# EAGLE board Eagle_LEDCUBE1 (EAGLE 6.5.0)
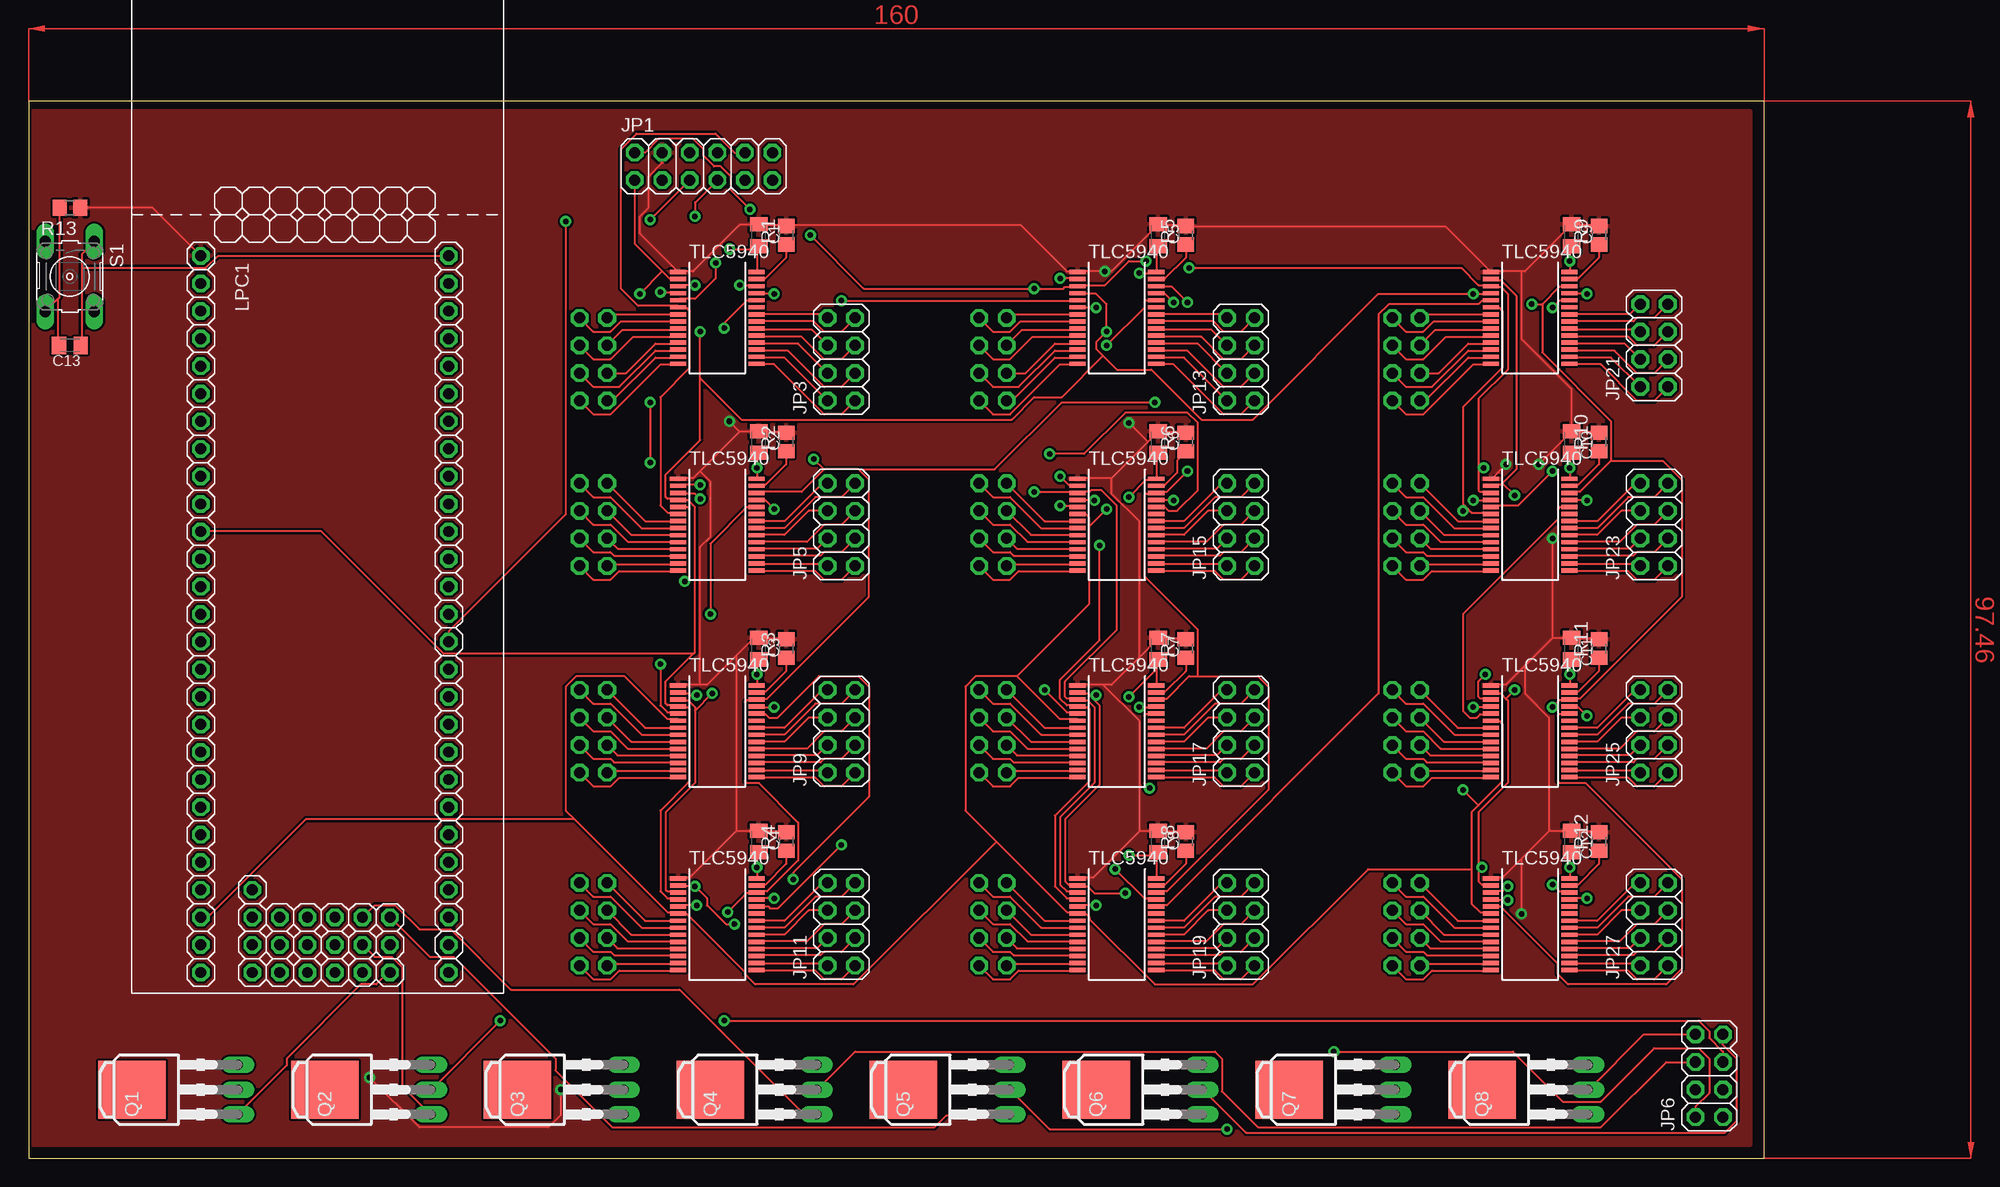
[diagram p5: board, top side]
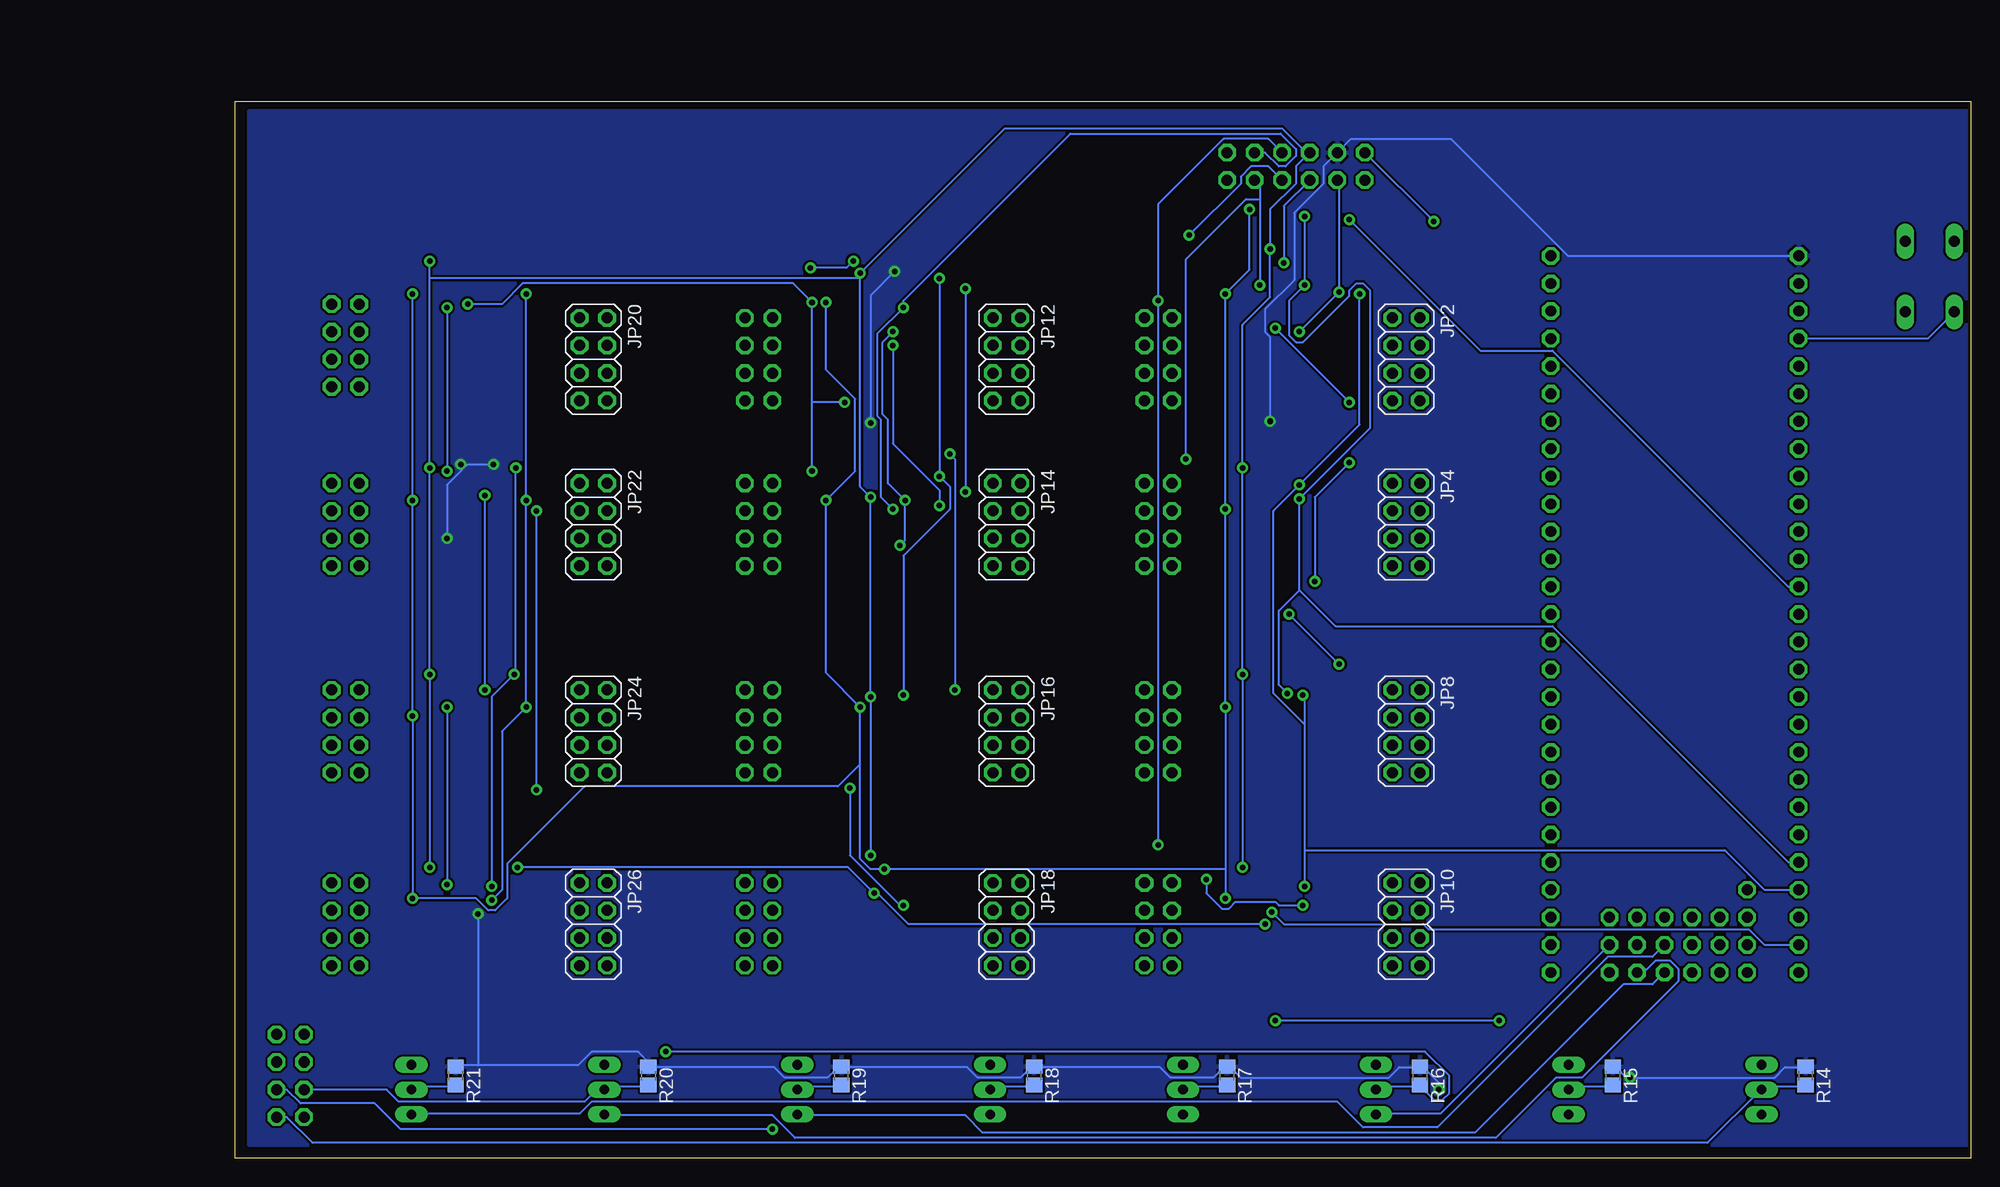
[diagram p6: board, bottom side, seen from below]

Size 160 x 97.46 mm. Coordinates in mm from the lower left corner, seen from the top.
Outline: 0,0 160,0 160,97.46 0,97.46 0,0
Copper layers (1*16): Top 0.035mm / dielectric 1.5mm / Bottom 0.035mm
Design rules "8mils": minimum track width 8mil, minimum drill 20mil, track to track 8mil, track to pad 8mil, pad to pad 8mil, via to via 8mil, smd to smd 8mil, copper to edge 10mil, drill to drill 8mil, minimum pad ring 12mil, minimum via ring 10mil, stop-mask expansion 4mil, vias tented up to drill 25mil, thermal gap 10mil

## Footprints (pad centres in the part's own frame; a part is rotated, then mirrored left to right if it is on the bottom)
C0805K = smd 1.3 x 1.6: 1 -1,0; 2 1,0
IC-SSOP28 = smd 0.4 x 1.5: 1 -4.225,-3.625; 2 -3.575,-3.625; 3 -2.925,-3.625; 4 -2.275,-3.625; 5 -1.625,-3.625; 6 -0.975,-3.625; 7 -0.325,-3.625; 8 0.325,-3.625; 9 0.975,-3.625; 10 1.625,-3.625; 11 2.275,-3.625; 12 2.925,-3.625; 13 3.575,-3.625; 14 4.225,-3.625; 15 4.225,3.625; 16 3.575,3.625; 17 2.925,3.625; 18 2.275,3.625; 19 1.625,3.625; 20 0.975,3.625; 21 0.325,3.625; 22 -0.325,3.625; 23 -0.975,3.625; 24 -1.625,3.625; 25 -2.275,3.625; 26 -2.925,3.625; 27 -3.575,3.625; 28 -4.225,3.625
2X06 = drill 1.016 octagon: 1 -6.35,-1.27; 2 -6.35,1.27; 3 -3.81,-1.27; 4 -3.81,1.27; 5 -1.27,-1.27; 6 -1.27,1.27; 7 1.27,-1.27; 8 1.27,1.27; 9 3.81,-1.27; 10 3.81,1.27; 11 6.35,-1.27; 12 6.35,1.27
2X04 = drill 1.016 octagon: 1 -3.81,-1.27; 2 -3.81,1.27; 3 -1.27,-1.27; 4 -1.27,1.27; 5 1.27,-1.27; 6 1.27,1.27; 7 3.81,-1.27; 8 3.81,1.27
LPCXPRESSO_LPC1769 = drill 1 octagon: 1 33.655,-5.715; 2 36.195,-5.715; 3 38.735,-5.715; 4 41.275,-5.715; 5 43.815,-5.715; 6 46.355,-5.715; 7 48.895,-5.715; 8 51.435,-5.715; 9 53.975,-5.715; 10 56.515,-5.715; 11 59.055,-5.715; 12 61.595,-5.715; 13 64.135,-5.715; 14 66.675,-5.715; 15 69.215,-5.715; 16 71.755,-5.715; 17 74.295,-5.715; 18 76.835,-5.715; 19 79.375,-5.715; 20 81.915,-5.715; 21 84.455,-5.715; 22 86.995,-5.715; 23 89.535,-5.715; 24 92.075,-5.715; 25 94.615,-5.715; 26 97.155,-5.715; 27 99.695,-5.715; 28 33.655,17.145; 29 36.195,17.145; 30 38.735,17.145; 31 41.275,17.145; 32 43.815,17.145; 33 46.355,17.145; 34 48.895,17.145; 35 51.435,17.145; 36 53.975,17.145; 37 56.515,17.145; 38 59.055,17.145; 39 61.595,17.145; 40 64.135,17.145; 41 66.675,17.145; 42 69.215,17.145; 43 71.755,17.145; 44 74.295,17.145; 45 76.835,17.145; 46 79.375,17.145; 47 81.915,17.145; 48 84.455,17.145; 49 86.995,17.145; 50 89.535,17.145; 51 92.075,17.145; 52 94.615,17.145; 53 97.155,17.145; 54 99.695,17.145; 55 92.075,-0.965; 56 94.615,-0.965; 57 97.155,-0.965; 58 99.695,-0.965; 59 94.615,1.575; 60 97.155,1.575; 61 99.695,1.575; 62 94.615,4.115; 63 97.155,4.115; 64 99.695,4.115; 65 94.615,6.655; 66 97.155,6.655; 67 99.695,6.655; 68 94.615,9.195; 69 97.155,9.195; 70 99.695,9.195; 71 94.615,11.735; 72 97.155,11.735; 73 99.695,11.735
TO251AA = drill 0.889 long: 1 -2.286,-5.334; 2 0,-5.334; 3 2.286,-5.334 | smd 5.334 x 6.223: 4 0,4.445
R0805 = smd 1.3 x 1.5: 1 -0.85,0; 2 0.85,0
R0805' = smd 1.3 x 1.5: 1 -0.95,0; 2 0.95,0
B3F-10XX = drill 1.016 long: 1 -3.251,2.261; 2 3.251,2.261; 3 -3.251,-2.261; 4 3.251,-2.261

## Placement (x,y rotation side)
C1  [C0805K]  67.31,85.09 270 top
C2  [C0805K]  67.31,66.04 270 top
C3  [C0805K]  67.31,46.99 270 top
C4  [C0805K]  67.31,29.21 270 top
C5  [C0805K]  104.14,85.09 270 top
C6  [C0805K]  104.14,66.04 270 top
C7  [C0805K]  104.14,46.99 270 top
C8  [C0805K]  104.14,29.21 270 top
C9  [C0805K]  142.24,85.09 270 top
C10  [C0805K]  142.24,66.04 270 top
C11  [C0805K]  142.24,46.99 270 top
C12  [C0805K]  142.24,29.21 270 top
C13  [C0805K]  3.81,74.93 180 top
IC1  [IC-SSOP28]  63.5,77.47 270 top
IC2  [IC-SSOP28]  63.5,58.42 270 top
IC3  [IC-SSOP28]  63.5,39.37 270 top
IC4  [IC-SSOP28]  63.5,21.59 270 top
IC5  [IC-SSOP28]  100.33,77.47 270 top
IC6  [IC-SSOP28]  100.33,58.42 270 top
IC7  [IC-SSOP28]  100.33,39.37 270 top
IC8  [IC-SSOP28]  100.33,21.59 270 top
IC9  [IC-SSOP28]  138.43,77.47 270 top
IC10  [IC-SSOP28]  138.43,58.42 270 top
IC11  [IC-SSOP28]  138.43,39.37 270 top
IC12  [IC-SSOP28]  138.43,21.59 270 top
JP1  [2X06]  62.23,91.44 0 top
JP2  [2X04]  52.07,73.66 270 bottom
JP3  [2X04]  74.93,73.66 90 top
JP4  [2X04]  52.07,58.42 270 bottom
JP5  [2X04]  74.93,58.42 90 top
JP6  [2X04]  154.94,7.62 90 top
JP8  [2X04]  52.07,39.37 270 bottom
JP9  [2X04]  74.93,39.37 90 top
JP10  [2X04]  52.07,21.59 270 bottom
JP11  [2X04]  74.93,21.59 90 top
JP12  [2X04]  88.9,73.66 270 bottom
JP13  [2X04]  111.76,73.66 90 top
JP14  [2X04]  88.9,58.42 270 bottom
JP15  [2X04]  111.76,58.42 90 top
JP16  [2X04]  88.9,39.37 270 bottom
JP17  [2X04]  111.76,39.37 90 top
JP18  [2X04]  88.9,21.59 270 bottom
JP19  [2X04]  111.76,21.59 90 top
JP20  [2X04]  127,73.66 270 bottom
JP21  [2X04]  149.86,74.93 90 top
JP22  [2X04]  127,58.42 270 bottom
JP23  [2X04]  149.86,58.42 90 top
JP24  [2X04]  127,39.37 270 bottom
JP25  [2X04]  149.86,39.37 90 top
JP26  [2X04]  127,21.59 270 bottom
JP27  [2X04]  149.86,21.59 90 top
LPC1  [LPCXPRESSO_LPC1769]  21.59,116.84 270 top
Q1  SPD30P06P  [TO251AA]  13.97,6.35 90 top
Q2  SPD30P06P  [TO251AA]  31.75,6.35 90 top
Q3  SPD30P06P  [TO251AA]  49.53,6.35 90 top
Q4  SPD30P06P  [TO251AA]  67.31,6.35 90 top
Q5  SPD30P06P  [TO251AA]  85.09,6.35 90 top
Q6  SPD30P06P  [TO251AA]  102.87,6.35 90 top
Q7  SPD30P06P  [TO251AA]  120.65,6.35 90 top
Q8  SPD30P06P  [TO251AA]  138.43,6.35 90 top
R1  2.2k  [R0805]  69.85,85.09 90 top
R2  2.2k  [R0805]  69.85,66.04 90 top
R3  2.2k  [R0805]  69.85,46.99 90 top
R4  2.2k  [R0805]  69.85,29.21 90 top
R5  2.2k  [R0805]  106.68,85.09 90 top
R6  2.2k  [R0805]  106.68,66.04 90 top
R7  2.2k  [R0805]  106.68,46.99 90 top
R8  2.2k  [R0805]  106.68,29.21 90 top
R9  2.2k  [R0805]  144.78,85.09 90 top
R10  2.2k  [R0805]  144.78,66.04 90 top
R11  2.2k  [R0805]  144.78,46.99 90 top
R12  2.2k  [R0805]  144.78,29.21 90 top
R13  [R0805']  3.81,87.63 180 top
R14  [R0805]  15.24,7.62 270 bottom
R15  [R0805]  33.02,7.62 270 bottom
R16  [R0805]  50.8,7.62 270 bottom
R17  [R0805]  68.58,7.62 270 bottom
R18  [R0805]  86.36,7.62 270 bottom
R19  [R0805]  104.14,7.62 270 bottom
R20  [R0805]  121.92,7.62 270 bottom
R21  [R0805]  139.7,7.62 270 bottom
S1  [B3F-10XX]  3.81,81.28 270 top

## Tracks (layer width: path | path; a pad name or v marks a point on that pad's centre or on a via)
2A1
  Top 0.203: JP12.1 90.49,77.79 96.68,77.79 IC5.7
2A2
  Top 0.203: JP12.2 88.9,76.2 90.49,76.2 91.44,77.15 96.68,77.15 IC5.8
2A3
  Top 0.203: JP12.3 91.6,76.36 96.68,76.36 IC5.9
2A4
  Top 0.203: JP12.4 88.9,73.66 90.49,73.66 92.55,75.72 96.68,75.72 IC5.10
2A5
  Top 0.203: JP12.5 91.92,72.39 94.61,75.09 96.68,75.09 IC5.11
2A6
  Top 0.203: JP12.6 88.9,71.12 91.28,71.12 94.61,74.45 96.68,74.45 IC5.12
2A7
  Top 0.203: JP12.7 90.65,69.85 94.61,73.82 96.68,73.82 IC5.13
2A8
  Top 0.203: JP12.8 88.9,68.58 90.49,68.58 95.09,73.18 96.68,73.18 IC5.14
2A9
  Top 0.203: JP13.1 111.76,68.58 110.17,68.58 105.57,73.18 103.98,73.18 IC5.15
2A10
  Top 0.203: JP13.2 106.52,73.82 103.98,73.82 IC5.16
2A11
  Top 0.203: JP13.3 111.76,71.12 110.17,71.12 106.84,74.45 103.98,74.45 IC5.17
2A12
  Top 0.203: JP13.4 107.79,75.09 103.98,75.09 IC5.18
2A13
  Top 0.203: JP13.5 111.76,73.66 110.17,73.66 108.11,75.72 103.98,75.72 IC5.19
2A14
  Top 0.203: JP13.6 109.06,76.36 103.98,76.36 IC5.20
2A15
  Top 0.203: JP13.7 111.76,76.2 110.17,76.2 109.22,77.15 103.98,77.15 IC5.21
2A16
  Top 0.203: JP13.8 110.17,77.79 103.98,77.79 IC5.22
2B1
  Top 0.203: JP14.1 93.66,58.74 96.68,58.74 IC6.7
2B2
  Top 0.203: JP14.2 88.9,60.96 90.49,60.96 93.34,58.1 96.68,58.1 IC6.8
2B3
  Top 0.203: JP14.3 92.39,57.47 96.68,57.47 IC6.9
2B4
  Top 0.203: JP14.4 88.9,58.42 90.49,58.42 92.08,56.83 96.68,56.83 IC6.10
2B5
  Top 0.203: JP14.5 91.12,56.2 96.68,56.2 IC6.11
2B6
  Top 0.203: JP14.6 88.9,55.88 90.49,55.88 90.81,55.56 96.68,55.56 IC6.12
2B7
  Top 0.203: JP14.7 90.33,54.77 96.68,54.77 IC6.13
2B8
  Top 0.203: JP14.8 88.9,53.34 90.49,53.34 91.28,54.13 96.68,54.13 IC6.14
2B9
  Top 0.203: JP15.1 111.76,53.34 110.17,53.34 109.38,54.13 103.98,54.13 IC6.15
2B10
  Top 0.203: JP15.2 110.33,54.77 103.98,54.77 IC6.16
2B11
  Top 0.203: JP15.3 111.76,55.88 110.17,55.88 109.86,55.56 103.98,55.56 IC6.17
2B12
  Top 0.203: JP15.4 109.54,56.2 103.98,56.2 IC6.18
2B13
  Top 0.203: JP15.5 111.76,58.42 110.17,58.42 108.58,56.83 103.98,56.83 IC6.19
2B14
  Top 0.203: JP15.6 108.74,59.69 106.52,57.47 103.98,57.47 IC6.20
2B15
  Top 0.203: JP15.7 111.76,60.96 109.38,60.96 106.52,58.1 103.98,58.1 IC6.21
2B16
  Top 0.203: JP15.8 110.01,62.23 106.52,58.74 103.98,58.74 IC6.22
2C1
  Top 0.203: JP16.1 93.66,39.69 96.68,39.69 IC7.7
2C2
  Top 0.203: JP16.2 88.9,41.91 90.49,41.91 93.34,39.05 96.68,39.05 IC7.8
2C3
  Top 0.203: JP16.3 92.39,38.42 96.68,38.42 IC7.9
2C4
  Top 0.203: JP16.4 88.9,39.37 90.49,39.37 92.08,37.78 96.68,37.78 IC7.10
2C5
  Top 0.203: JP16.5 91.12,37.15 96.68,37.15 IC7.11
2C6
  Top 0.203: JP16.6 88.9,36.83 90.49,36.83 90.81,36.51 96.68,36.51 IC7.12
2C7
  Top 0.203: JP16.7 90.33,35.72 96.68,35.72 IC7.13
2C8
  Top 0.203: JP16.8 88.9,34.29 90.49,34.29 91.28,35.08 96.68,35.08 IC7.14
2C9
  Top 0.203: JP17.1 111.76,34.29 110.17,34.29 109.38,35.08 103.98,35.08 IC7.15
2C10
  Top 0.203: JP17.2 110.33,35.72 103.98,35.72 IC7.16
2C11
  Top 0.203: JP17.3 111.76,36.83 110.17,36.83 109.86,36.51 103.98,36.51 IC7.17
2C12
  Top 0.203: JP17.4 109.54,37.15 103.98,37.15 IC7.18
2C13
  Top 0.203: JP17.5 111.76,39.37 110.17,39.37 108.58,37.78 103.98,37.78 IC7.19
2C14
  Top 0.203: JP17.6 108.74,40.64 106.52,38.42 103.98,38.42 IC7.20
2C15
  Top 0.203: JP17.7 111.76,41.91 109.38,41.91 106.52,39.05 103.98,39.05 IC7.21
2C16
  Top 0.203: JP17.8 110.01,43.18 106.52,39.69 103.98,39.69 IC7.22
2D1
  Top 0.203: JP18.1 93.66,21.91 96.68,21.91 IC8.7
2D2
  Top 0.203: JP18.2 88.9,24.13 90.49,24.13 93.34,21.27 96.68,21.27 IC8.8
2D3
  Top 0.203: JP18.3 92.39,20.64 96.68,20.64 IC8.9
2D4
  Top 0.203: JP18.4 88.9,21.59 90.49,21.59 92.08,20 96.68,20 IC8.10
2D5
  Top 0.203: JP18.5 91.12,19.37 96.68,19.37 IC8.11
2D6
  Top 0.203: JP18.6 88.9,19.05 90.49,19.05 90.81,18.73 96.68,18.73 IC8.12
2D7
  Top 0.203: JP18.7 90.33,17.94 96.68,17.94 IC8.13
2D8
  Top 0.203: JP18.8 88.9,16.51 90.49,16.51 91.28,17.3 96.68,17.3 IC8.14
2D9
  Top 0.203: JP19.1 111.76,16.51 110.17,16.51 109.38,17.3 103.98,17.3 IC8.15
2D10
  Top 0.203: JP19.2 110.33,17.94 103.98,17.94 IC8.16
2D11
  Top 0.203: JP19.3 111.76,19.05 110.17,19.05 109.86,18.73 103.98,18.73 IC8.17
2D12
  Top 0.203: JP19.4 109.54,19.37 103.98,19.37 IC8.18
2D13
  Top 0.203: JP19.5 111.76,21.59 110.17,21.59 108.58,20 103.98,20 IC8.19
2D14
  Top 0.203: JP19.6 108.74,22.86 106.52,20.64 103.98,20.64 IC8.20
2D15
  Top 0.203: JP19.7 111.76,24.13 109.38,24.13 106.52,21.27 103.98,21.27 IC8.21
2D16
  Top 0.203: JP19.8 110.01,25.4 106.52,21.91 103.98,21.91 IC8.22
2SIN  (via drill 0.51)
  Top 0.203: v74.93,28.89 69.06,23.02 68.42,23.02 68.26,23.18 67.15,23.18 IC4.24 | v74.93,79.06 96.68,79.06 IC5.5
  Bottom 0.203: v74.93,28.89 v74.93,79.06 74.93,87.95 68.9,93.98 64.77,93.98 JP1.8
2SIN_B  (via drill 0.51)
  Top 0.203: v95.09,60.17 96.68,60.17 IC6.5 | v99.38,74.93 102.87,78.42 102.87,78.9 103.03,79.06 103.82,79.06 IC5.24
  Bottom 0.203: v95.09,60.17 95.09,61.59 99.38,65.88 v99.38,74.93
2SIN_C  (via drill 0.51)
  Top 0.203: v93.66,43.18 95.73,41.12 96.68,41.12 IC7.5 | v94.14,64.93 97.31,64.93 101.12,68.74 106.84,68.74 107.79,67.79 107.79,61.59 105.89,59.69 105.09,59.69 104.78,60.01 103.98,60.01 IC6.24
  Bottom 0.203: v93.66,43.18 93.66,64.45 v94.14,64.93
2SIN_D  (via drill 0.51)
  Top 0.203: v98.42,23.34 96.84,23.34 IC8.5 | v103.35,34.13 102.87,34.61 102.87,40.8 103.03,40.96 103.82,40.96 IC7.24
  Bottom 0.203: v98.42,23.34 98.74,23.34 103.35,27.94 v103.35,34.13
3.3V
  Top 0.203: 4.92,82.07 4.92,83.34 6.03,84.45 S1.1 | 4.92,82.07 4.92,74.93 C13.1 | LPC1.28 17.46,83.19 16.35,82.07 4.92,82.07
3A1
  Top 0.203: JP20.1 128.59,77.79 134.78,77.79 IC9.7
3A2
  Top 0.203: JP20.2 127,76.2 128.59,76.2 129.54,77.15 134.78,77.15 IC9.8
3A3
  Top 0.203: JP20.3 129.7,76.36 134.78,76.36 IC9.9
3A4
  Top 0.203: JP20.4 127,73.66 128.59,73.66 130.65,75.72 134.78,75.72 IC9.10
3A5
  Top 0.203: JP20.5 130.02,72.39 132.72,75.09 134.78,75.09 IC9.11
3A6
  Top 0.203: JP20.6 127,71.12 129.38,71.12 132.72,74.45 134.78,74.45 IC9.12
3A7
  Top 0.203: JP20.7 128.75,69.85 132.72,73.82 134.78,73.82 IC9.13
3A8
  Top 0.203: JP20.8 127,68.58 128.59,68.58 133.19,73.18 134.78,73.18 IC9.14
3A9
  Top 0.203: JP21.1 149.86,69.85 148.27,69.85 144.94,73.18 142.08,73.18 IC9.15
3A10
  Top 0.203: JP21.2 145.89,73.82 142.08,73.82 IC9.16
3A11
  Top 0.203: JP21.3 149.86,72.39 148.27,72.39 146.21,74.45 142.08,74.45 IC9.17
3A12
  Top 0.203: JP21.4 147.16,75.09 142.08,75.09 IC9.18
3A13
  Top 0.203: JP21.5 149.86,74.93 148.27,74.93 147.48,75.72 142.08,75.72 IC9.19
3A14
  Top 0.203: JP21.6 148.43,76.36 142.08,76.36 IC9.20
3A15
  Top 0.203: JP21.7 149.86,77.47 148.27,77.47 147.96,77.15 142.08,77.15 IC9.21
3A16
  Top 0.203: JP21.8 147.64,77.79 142.08,77.79 IC9.22
3B1
  Top 0.203: JP22.1 131.76,58.74 134.78,58.74 IC10.7
3B2
  Top 0.203: JP22.2 127,60.96 128.59,60.96 131.44,58.1 134.78,58.1 IC10.8
3B3
  Top 0.203: JP22.3 130.49,57.47 134.78,57.47 IC10.9
3B4
  Top 0.203: JP22.4 127,58.42 128.59,58.42 130.18,56.83 134.78,56.83 IC10.10
3B5
  Top 0.203: JP22.5 129.22,56.2 134.78,56.2 IC10.11
3B6
  Top 0.203: JP22.6 127,55.88 128.59,55.88 128.91,55.56 134.78,55.56 IC10.12
3B7
  Top 0.203: JP22.7 128.43,54.77 134.78,54.77 IC10.13
3B8
  Top 0.203: JP22.8 127,53.34 128.59,53.34 129.38,54.13 134.78,54.13 IC10.14
3B9
  Top 0.203: JP23.1 149.86,53.34 148.27,53.34 147.48,54.13 142.08,54.13 IC10.15
3B10
  Top 0.203: JP23.2 148.43,54.77 142.08,54.77 IC10.16
3B11
  Top 0.203: JP23.3 149.86,55.88 148.27,55.88 147.96,55.56 142.08,55.56 IC10.17
3B12
  Top 0.203: JP23.4 147.64,56.2 142.08,56.2 IC10.18
3B13
  Top 0.203: JP23.5 149.86,58.42 148.27,58.42 146.69,56.83 142.08,56.83 IC10.19
3B14
  Top 0.203: JP23.6 146.84,59.69 144.62,57.47 142.08,57.47 IC10.20
3B15
  Top 0.203: JP23.7 149.86,60.96 147.48,60.96 144.62,58.1 142.08,58.1 IC10.21
3B16
  Top 0.203: JP23.8 148.11,62.23 144.62,58.74 142.08,58.74 IC10.22
3C1
  Top 0.203: JP24.1 131.76,39.69 134.78,39.69 IC11.7
3C2
  Top 0.203: JP24.2 127,41.91 128.59,41.91 131.44,39.05 134.78,39.05 IC11.8
3C3
  Top 0.203: JP24.3 130.49,38.42 134.78,38.42 IC11.9
3C4
  Top 0.203: JP24.4 127,39.37 128.59,39.37 130.18,37.78 134.78,37.78 IC11.10
3C5
  Top 0.203: JP24.5 129.22,37.15 134.78,37.15 IC11.11
3C6
  Top 0.203: JP24.6 127,36.83 128.59,36.83 128.91,36.51 134.78,36.51 IC11.12
3C7
  Top 0.203: JP24.7 128.43,35.72 134.78,35.72 IC11.13
3C8
  Top 0.203: JP24.8 127,34.29 128.59,34.29 129.38,35.08 134.78,35.08 IC11.14
3C9
  Top 0.203: JP25.1 149.86,34.29 148.27,34.29 147.48,35.08 142.08,35.08 IC11.15
3C10
  Top 0.203: JP25.2 148.43,35.72 142.08,35.72 IC11.16
3C11
  Top 0.203: JP25.3 149.86,36.83 148.27,36.83 147.96,36.51 142.08,36.51 IC11.17
3C12
  Top 0.203: JP25.4 147.64,37.15 142.08,37.15 IC11.18
3C13
  Top 0.203: JP25.5 149.86,39.37 148.27,39.37 146.69,37.78 142.08,37.78 IC11.19
3C14
  Top 0.203: JP25.6 146.84,40.64 144.62,38.42 142.08,38.42 IC11.20
3C15
  Top 0.203: JP25.7 149.86,41.91 147.48,41.91 144.62,39.05 142.08,39.05 IC11.21
3C16
  Top 0.203: JP25.8 148.11,43.18 144.62,39.69 142.08,39.69 IC11.22
3D1
  Top 0.203: JP26.1 131.76,21.91 134.78,21.91 IC12.7
3D2
  Top 0.203: JP26.2 127,24.13 128.59,24.13 131.44,21.27 134.78,21.27 IC12.8
3D3
  Top 0.203: JP26.3 130.49,20.64 134.78,20.64 IC12.9
3D4
  Top 0.203: JP26.4 127,21.59 128.59,21.59 130.18,20 134.78,20 IC12.10
3D5
  Top 0.203: JP26.5 129.22,19.37 134.78,19.37 IC12.11
3D6
  Top 0.203: JP26.6 127,19.05 128.59,19.05 128.91,18.73 134.78,18.73 IC12.12
3D7
  Top 0.203: JP26.7 128.43,17.94 134.78,17.94 IC12.13
3D8
  Top 0.203: JP26.8 127,16.51 128.59,16.51 129.38,17.3 134.78,17.3 IC12.14
3D9
  Top 0.203: JP27.1 149.86,16.51 148.27,16.51 147.48,17.3 142.08,17.3 IC12.15
3D10
  Top 0.203: JP27.2 148.43,17.94 142.08,17.94 IC12.16
3D11
  Top 0.203: JP27.3 149.86,19.05 148.27,19.05 147.96,18.73 142.08,18.73 IC12.17
3D12
  Top 0.203: JP27.4 147.64,19.37 142.08,19.37 IC12.18
3D13
  Top 0.203: JP27.5 149.86,21.59 148.27,21.59 146.69,20 142.08,20 IC12.19
3D14
  Top 0.203: JP27.6 146.84,22.86 144.62,20.64 142.08,20.64 IC12.20
3D15
  Top 0.203: JP27.7 149.86,24.13 147.48,24.13 144.62,21.27 142.08,21.27 IC12.21
3D16
  Top 0.203: JP27.8 148.11,25.4 144.62,21.91 142.08,21.91 IC12.22
3SIN
  Top 0.203: IC8.24 103.98,23.34 104.93,23.34 124.46,42.86 124.46,77.79 125.41,78.74 133.67,78.74 133.99,79.06 134.78,79.06 IC9.5
3SIN_B  (via drill 0.51)
  Top 0.203: v140.49,63.34 137.32,60.17 134.94,60.17 IC10.5 | v140.49,78.42 141.13,79.06 141.92,79.06 IC9.24
  Bottom 0.203: v140.49,78.42 v140.49,63.34
3SIN_C
  Top 0.203: IC11.5 134.78,40.96 133.83,40.96 133.51,40.64 132.87,40.64 132.24,41.27 132.24,50.16 140.97,58.9 140.97,59.85 141.13,60.01 141.92,60.01 IC10.24
3SIN_D
  Top 0.203: IC12.5 134.94,23.18 135.73,23.18 140.97,17.94 140.97,16.99 141.92,16.03 150.97,16.03 152.4,17.46 152.4,25.72 143.51,34.61 141.13,34.61 140.97,34.77 140.97,40.8 141.13,40.96 141.92,40.96 IC11.24
A1
  Top 0.203: JP2.1 53.66,77.79 59.85,77.79 IC1.7
A2
  Top 0.203: JP2.2 52.07,76.2 53.66,76.2 54.61,77.15 59.85,77.15 IC1.8
A3
  Top 0.203: JP2.3 54.77,76.36 59.85,76.36 IC1.9
A4
  Top 0.203: JP2.4 52.07,73.66 53.66,73.66 55.72,75.72 59.85,75.72 IC1.10
A5
  Top 0.203: JP2.5 55.09,72.39 57.78,75.09 59.85,75.09 IC1.11
A6
  Top 0.203: JP2.6 52.07,71.12 54.45,71.12 57.78,74.45 59.85,74.45 IC1.12
A7
  Top 0.203: JP2.7 53.82,69.85 57.78,73.82 59.85,73.82 IC1.13
A8
  Top 0.203: JP2.8 52.07,68.58 53.66,68.58 58.26,73.18 59.85,73.18 IC1.14
A9
  Top 0.203: JP3.1 74.93,68.58 73.34,68.58 68.74,73.18 67.15,73.18 IC1.15
A10
  Top 0.203: JP3.2 69.69,73.82 67.15,73.82 IC1.16
A11
  Top 0.203: JP3.3 74.93,71.12 73.34,71.12 70.01,74.45 67.15,74.45 IC1.17
A12
  Top 0.203: JP3.4 70.96,75.09 67.15,75.09 IC1.18
A13
  Top 0.203: JP3.5 74.93,73.66 73.34,73.66 71.28,75.72 67.15,75.72 IC1.19
A14
  Top 0.203: JP3.6 72.23,76.36 67.15,76.36 IC1.20
A15
  Top 0.203: JP3.7 74.93,76.2 73.34,76.2 72.39,77.15 67.15,77.15 IC1.21
A16
  Top 0.203: JP3.8 73.34,77.79 67.15,77.79 IC1.22
B1
  Top 0.203: JP4.1 56.83,58.74 59.85,58.74 IC2.7
B2
  Top 0.203: JP4.2 52.07,60.96 53.66,60.96 56.52,58.1 59.85,58.1 IC2.8
B3
  Top 0.203: JP4.3 55.56,57.47 59.85,57.47 IC2.9
B4
  Top 0.203: JP4.4 52.07,58.42 53.66,58.42 55.24,56.83 59.85,56.83 IC2.10
B5
  Top 0.203: JP4.5 54.29,56.2 59.85,56.2 IC2.11
B6
  Top 0.203: JP4.6 52.07,55.88 53.66,55.88 53.98,55.56 59.85,55.56 IC2.12
B7
  Top 0.203: JP4.7 53.5,54.77 59.85,54.77 IC2.13
B8
  Top 0.203: JP4.8 52.07,53.34 53.66,53.34 54.45,54.13 59.85,54.13 IC2.14
B9
  Top 0.203: JP5.1 74.93,53.34 73.34,53.34 72.55,54.13 67.15,54.13 IC2.15
B10
  Top 0.203: JP5.2 73.5,54.77 67.15,54.77 IC2.16
B11
  Top 0.203: JP5.3 74.93,55.88 73.34,55.88 73.03,55.56 67.15,55.56 IC2.17
B12
  Top 0.203: JP5.4 72.71,56.2 67.15,56.2 IC2.18
B13
  Top 0.203: JP5.5 74.93,58.42 73.34,58.42 71.75,56.83 67.15,56.83 IC2.19
B14
  Top 0.203: JP5.6 71.91,59.69 69.69,57.47 67.15,57.47 IC2.20
B15
  Top 0.203: JP5.7 74.93,60.96 72.55,60.96 69.69,58.1 67.15,58.1 IC2.21
B16
  Top 0.203: JP5.8 73.18,62.23 69.69,58.74 67.15,58.74 IC2.22
BLANK  (via drill 0.51)
  Top 0.203: 133.67,26.83 133.67,31.91 136.37,34.61 136.37,42.23 136.21,42.39 | 133.67,26.83 133.67,25.56 133.99,25.24 134.78,25.24 IC12.2 | 136.21,42.39 135.73,42.86 134.94,42.86 IC11.2 | 135.89,62.23 137.16,63.5 137.16,79.53 135.73,80.96 134.94,80.96 IC9.2 | 135.89,62.23 135.73,62.07 134.94,62.07 IC10.2 | v137,43.18 136.21,42.39 | 135.89,62.23 v137,61.12 | 98.11,42.39 97.63,42.86 96.84,42.86 IC7.2 | 98.11,42.39 98.74,41.75 98.74,34.45 95.57,31.27 95.57,25.56 95.89,25.24 96.68,25.24 IC8.2 96.84,25.08 97.63,25.08 98.27,24.45 v101.12,24.45 | v95.09,62.86 95.89,62.07 96.68,62.07 IC6.2 | v95.09,81.12 96.68,81.12 IC5.2 | v98.42,42.7 98.11,42.39 | v133.99,26.83 133.67,26.83 | 58.42,81.76 55.88,84.3 JP1.1 | 58.42,81.76 59.05,81.12 59.85,81.12 IC1.2 | v61.59,42.7 60.96,42.7 60.8,42.86 60.01,42.86 IC3.2 | IC4.2 60.01,25.08 v61.44,25.08 62.55,23.97 62.55,23.34 64.29,21.59 v65.09,21.59 | v61.91,62.07 60.01,62.07 IC2.2 | v56.36,79.69 58.42,81.76
  Bottom 0.203: v137,61.12 v137,43.18 | v95.09,81.12 v95.09,62.86 94.14,61.91 94.14,59.85 98.42,55.56 v98.42,42.7 | v133.99,26.83 103.5,26.83 v101.12,24.45 100.81,24.45 97.95,21.59 v65.09,21.59 | 61.44,40 61.44,42.55 v61.59,42.7 | 61.44,40 61.44,28.42 | 61.44,28.42 v61.44,25.08 | 61.44,40 64.29,42.86 64.29,59.69 v61.91,62.07 56.36,67.63 v56.36,79.69 | LPC1.24 19.05,24.77 22.7,28.42 61.44,28.42
C1
  Top 0.203: JP8.1 56.83,39.69 59.85,39.69 IC3.7
C2
  Top 0.203: JP8.2 52.07,41.91 53.66,41.91 56.52,39.05 59.85,39.05 IC3.8
C3
  Top 0.203: JP8.3 55.56,38.42 59.85,38.42 IC3.9
C4
  Top 0.203: JP8.4 52.07,39.37 53.66,39.37 55.24,37.78 59.85,37.78 IC3.10
C5
  Top 0.203: JP8.5 54.29,37.15 59.85,37.15 IC3.11
C6
  Top 0.203: JP8.6 52.07,36.83 53.66,36.83 53.98,36.51 59.85,36.51 IC3.12
C7
  Top 0.203: JP8.7 53.5,35.72 59.85,35.72 IC3.13
C8
  Top 0.203: JP8.8 52.07,34.29 53.66,34.29 54.45,35.08 59.85,35.08 IC3.14
C9
  Top 0.203: JP9.1 74.93,34.29 73.34,34.29 72.55,35.08 67.15,35.08 IC3.15
C10
  Top 0.203: JP9.2 73.5,35.72 67.15,35.72 IC3.16
C11
  Top 0.203: JP9.3 74.93,36.83 73.34,36.83 73.03,36.51 67.15,36.51 IC3.17
C12
  Top 0.203: JP9.4 72.71,37.15 67.15,37.15 IC3.18
C13
  Top 0.203: JP9.5 74.93,39.37 73.34,39.37 71.75,37.78 67.15,37.78 IC3.19
C14
  Top 0.203: JP9.6 71.91,40.64 69.69,38.42 67.15,38.42 IC3.20
C15
  Top 0.203: JP9.7 74.93,41.91 72.55,41.91 69.69,39.05 67.15,39.05 IC3.21
C16
  Top 0.203: JP9.8 73.18,43.18 69.69,39.69 67.15,39.69 IC3.22
D1
  Top 0.203: JP10.1 56.83,21.91 59.85,21.91 IC4.7
D2
  Top 0.203: JP10.2 52.07,24.13 53.66,24.13 56.52,21.27 59.85,21.27 IC4.8
D3
  Top 0.203: JP10.3 55.56,20.64 59.85,20.64 IC4.9
D4
  Top 0.203: JP10.4 52.07,21.59 53.66,21.59 55.24,20 59.85,20 IC4.10
D5
  Top 0.203: JP10.5 54.29,19.37 59.85,19.37 IC4.11
D6
  Top 0.203: JP10.6 52.07,19.05 53.66,19.05 53.98,18.73 59.85,18.73 IC4.12
D7
  Top 0.203: JP10.7 53.5,17.94 59.85,17.94 IC4.13
D8
  Top 0.203: JP10.8 52.07,16.51 53.66,16.51 54.45,17.3 59.85,17.3 IC4.14
D9
  Top 0.203: JP11.1 74.93,16.51 73.34,16.51 72.55,17.3 67.15,17.3 IC4.15
D10
  Top 0.203: JP11.2 73.5,17.94 67.15,17.94 IC4.16
D11
  Top 0.203: JP11.3 74.93,19.05 73.34,19.05 73.03,18.73 67.15,18.73 IC4.17
D12
  Top 0.203: JP11.4 72.71,19.37 67.15,19.37 IC4.18
D13
  Top 0.203: JP11.5 74.93,21.59 73.34,21.59 71.75,20 67.15,20 IC4.19
D14
  Top 0.203: JP11.6 71.91,22.86 69.69,20.64 67.15,20.64 IC4.20
D15
  Top 0.203: JP11.7 74.93,24.13 72.55,24.13 69.69,21.27 67.15,21.27 IC4.21
D16
  Top 0.203: JP11.8 73.18,25.4 69.69,21.91 67.15,21.91 IC4.22
DCPRG  (via drill 0.51)
  Top 0.203: v140.49,25.24 141.13,24.61 141.92,24.61 IC12.26 | v140.49,41.59 141.13,42.23 141.92,42.23 IC11.26 142.08,42.39 143.03,42.39 152.4,51.75 152.4,62.55 150.65,64.29 145.89,64.29 | 145.89,64.29 143.03,61.44 142.08,61.44 IC10.26 | 145.89,64.29 145.89,67.95 139.54,74.3 139.54,78.74 | 139.54,78.74 141.13,80.33 141.92,80.33 IC9.26 | 107.79,44.45 107,44.45 104.93,42.39 103.98,42.39 IC7.26 | 107.79,44.45 113.35,44.45 114.3,43.5 114.3,33.97 104.93,24.61 103.98,24.61 IC8.26 | 107.79,44.45 107.79,48.74 102.87,53.66 102.87,61.12 103.03,61.28 103.82,61.28 IC6.26 103.98,61.44 104.93,61.44 v106.84,63.34 | v106.84,78.9 105.41,80.33 103.98,80.33 IC5.26 | v65.56,80.49 66.99,80.49 IC1.26 | 73.34,63.5 71.28,61.44 67.15,61.44 IC2.26 | 76.52,63.5 73.34,63.5 | 76.52,63.5 77.47,62.55 77.47,51.75 68.1,42.39 67.15,42.39 IC3.26 66.99,42.23 66.2,42.23 66.04,42.07 66.04,34.77 66.2,34.61 67.31,34.61 70.96,30.96 70.96,27.46 68.1,24.61 67.15,24.61 IC4.26 66.99,24.45 66.2,24.45 v64.45,22.7 | 73.34,63.5 v72.39,64.45 | v103.82,69.69 95.25,69.69 89.06,63.5 76.52,63.5 | v138.59,78.74 139.54,78.74
  Bottom 0.203: v140.49,41.59 v140.49,25.24 | v106.84,63.34 106.84,69.69 | 106.84,69.69 v106.84,78.9 108.58,80.64 133.51,80.64 135.41,78.74 v138.59,78.74 | 65.56,88.42 65.56,89.69 JP1.9 | 65.56,88.42 v65.56,80.49 | LPC1.26 19.05,19.69 20.48,21.11 50.01,21.11 50.48,21.59 63.34,21.59 v64.45,22.7 | 65.56,88.42 66.83,88.42 72.39,82.87 v72.39,64.45 | v103.82,69.69 106.84,69.69
GND  (via drill 0.51)
  Top 0.203: 99.85,62.71 96.84,62.71 IC6.1 | 104.14,66.99 103.19,66.04 | 103.19,66.04 99.85,62.71 | 104.14,66.99 106.68,66.99 R6.2 | 104.14,66.99 C6.1 | 102.39,30.16 98.11,25.88 96.84,25.88 IC8.1 | 104.14,30.16 102.39,30.16 | 104.14,30.16 106.68,30.16 R8.2 | 104.14,30.16 C8.1 | 99.06,43.66 99.85,43.66 102.39,46.2 | 99.06,43.66 96.84,43.66 IC7.1 | 104.14,47.94 102.39,46.2 | 104.14,47.94 106.68,47.94 R7.2 | 104.14,47.94 C7.1 | 102.39,30.16 102.39,40.32 99.06,43.66 | 99.85,62.71 99.85,61.28 102.39,58.74 102.39,46.2 | 140.18,30.16 137.64,27.62 | 137.64,27.62 135.89,25.88 134.94,25.88 IC12.1 | 142.24,30.16 140.18,30.16 | 142.24,30.16 144.78,30.16 R12.2 | 142.24,30.16 C12.1 | 140.49,47.94 137.95,45.4 | 137.95,45.4 136.21,43.66 134.94,43.66 IC11.1 | 142.24,47.94 140.49,47.94 | 142.24,47.94 144.78,47.94 R11.2 | 142.24,47.94 C11.1 | 140.18,30.16 140.18,40.64 137.95,42.86 137.95,45.4 | v136.21,63.98 134.94,62.71 IC10.1 | 142.24,66.99 v139.22,63.98 | 142.24,66.99 144.78,66.99 R10.2 | 142.24,66.99 C10.1 142.24,70.96 137.64,75.56 137.64,81.76 | 104.14,86.04 99.85,81.76 v99.22,81.76 96.84,81.76 IC5.1 96.68,81.76 95.73,81.76 91.44,86.04 69.85,86.04 | 104.14,86.04 106.68,86.04 R5.2 106.68,85.88 130.65,85.88 134.78,81.76 IC9.1 134.94,81.76 137.64,81.76 | 104.14,86.04 C5.1 | 137.64,81.76 137.95,81.76 142.24,86.04 | 142.24,86.04 144.78,86.04 R9.2 | 142.24,86.04 C9.1 | v140.49,57.15 140.49,47.94 | v101.44,67.79 103.19,66.04 | 65.56,66.99 61.91,63.34 | 61.91,63.34 61.28,62.71 60.01,62.71 IC2.1 | 67.31,66.99 65.56,66.99 | 67.31,66.99 69.85,66.99 R2.2 | 67.31,66.99 C2.1 | 65.25,30.16 60.96,25.88 60.01,25.88 IC4.1 | 67.31,30.16 65.25,30.16 | 67.31,30.16 69.85,30.16 R4.2
  Top 0.203: 67.31,30.16 C4.1 | 61.91,43.66 62.55,43.66 65.25,46.35 | 61.91,43.66 60.01,43.66 IC3.1 | 65.25,46.35 66.83,47.94 67.31,47.94 | 67.31,47.94 69.85,47.94 R3.2 | 67.31,47.94 C3.1 | 65.25,46.35 65.25,30.16 | 61.91,63.34 62.87,62.39 62.87,57.31 61.91,56.36 61.91,43.66 | R13.1 11.43,87.63 LPC1.1 | 67.31,86.04 65.56,86.04 61.28,81.76 60.01,81.76 IC1.1 59.85,81.76 56.36,85.25 56.36,86.84 57.15,87.63 57.15,90.49 58.42,91.76 JP1.4 | 67.31,86.04 69.85,86.04 | 67.31,86.04 C1.1 | v64.61,67.95 65.56,66.99 | 69.85,86.04 R1.2 | v31.43,7.46 36.04,2.86 47.94,2.86 49.05,3.97 v49.05,6.35 | 137.64,27.62 v137.64,22.54
  Bottom 0.203: v139.22,63.98 138.59,63.98 | 138.59,63.98 v136.21,63.98 | v140.49,57.15 140.49,62.07 138.59,63.98 | v101.44,67.79 101.44,79.53 v99.22,81.76 | LPC1.1 37.15,83.19 47.94,93.98 57.15,93.98 JP1.4 59.69,91.44 59.69,89.85 62.39,87.15 62.39,80.96 65.09,78.26 65.09,76.2 64.61,75.72 v64.61,67.95 | R14.1 15.24,8.41 17.14,8.41 18.1,7.46 v31.43,7.46 31.75,7.46 32.7,8.41 33.02,8.41 R15.1 | 50.8,8.41 52.7,8.41 53.66,7.46 67.31,7.46 68.26,8.41 68.58,8.41 | 86.36,8.41 74.77,8.41 73.82,7.46 69.85,7.46 68.9,8.41 68.58,8.41 | 68.58,8.41 R17.1 | 104.14,8.41 92.55,8.41 91.6,7.46 87.63,7.46 86.68,8.41 86.36,8.41 | 86.36,8.41 R18.1 | 121.44,8.41 110.33,8.41 109.38,7.46 105.41,7.46 104.46,8.41 104.14,8.41 | 121.44,8.41 121.92,8.41 R20.1 121.44,8.41 | 104.14,8.41 R19.1 | 137.64,8.57 128.43,8.57 127.16,9.84 122.87,9.84 121.44,8.41 | 137.64,8.57 139.7,8.57 R21.1 | v49.05,6.35 49.05,6.99 50.48,8.41 50.8,8.41 | 50.8,8.41 R16.1 | v137.64,22.54 137.64,8.57
  pour Top: 1.27,96.52 0,96.52 0,1.27 158.75,1.27 158.75,3.81 158.75,95.25 158.75,96.52
  pour Bottom: 1.27,96.52 0,96.52 0,1.27 158.75,1.27 158.75,3.81 158.75,95.25 158.75,96.52
GSCLK  (via drill 0.51)
  Top 0.203: LPC1.42 38.73,48.58 49.53,59.37 v49.53,86.36 | v143.67,23.97 142.08,23.97 IC12.25 | v143.67,40.8 142.88,41.59 142.08,41.59 IC11.25 | v143.67,60.64 142.08,60.64 IC10.25 | v143.67,79.69 142.08,79.69 IC9.25 | v68.74,23.97 67.15,23.97 IC4.25 | v68.74,41.59 67.15,41.59 IC3.25 | v100.17,26.67 102.87,23.97 103.82,23.97 IC8.25 | v102.39,41.59 103.82,41.59 IC7.25 | v68.74,59.85 67.94,60.64 67.15,60.64 IC2.25 | v105.57,60.64 103.98,60.64 IC6.25 | v68.74,79.69 67.15,79.69 IC1.25 | v105.57,78.9 104.78,79.69 103.98,79.69 IC5.25 | JP1.2 56.83,92.71 58.1,93.98 61.28,93.98 62.23,93.03 62.23,92.39 63.18,91.44 63.82,91.44 64.77,90.49 64.77,89.22 v66.52,87.47
  Bottom 0.203: JP1.2 v49.53,86.36 | v143.67,79.69 v143.67,60.64 v143.67,40.8 v143.67,23.97 137.79,23.97 136.68,22.86 136.05,22.86 134.94,23.97 134.94,27.15 127.79,34.29 104.46,34.29 102.39,36.35 | 68.74,26.67 v68.74,41.59 v68.74,59.85 v68.74,79.69 66.52,81.91 v66.52,87.47 | 68.74,26.67 v68.74,23.97 | 68.74,26.67 v100.17,26.67 101.44,26.67 102.39,27.62 102.39,36.35 | 102.39,36.35 v102.39,41.59 105.57,44.77 v105.57,60.64 102.87,63.34 102.87,70.01 105.57,72.71 v105.57,78.9
L1
  Bottom 0.203: R14.2 15.24,6.67 18.89,6.67 19.21,6.35 Q1.2 19.37,6.35 24.29,1.43 152.88,1.43 155.26,3.81 JP6.1
L2  (via drill 0.51)
  Top 0.203: JP6.2 153.67,4.76 154.94,6.03 154.94,9.21 153.99,10.16 149.86,10.16 144.94,5.24 141.45,5.24 136.84,9.84 v120.33,9.84
  Bottom 0.203: 50.8,6.67 54.45,6.67 54.77,6.35 Q3.2 | v120.33,9.84 50.32,9.84 48.1,7.62 48.1,6.03 48.74,5.4 49.53,5.4 50.8,6.67 | 50.8,6.67 R16.2
L3  (via drill 0.51)
  Top 0.203: v110.49,2.7 94.14,2.7 90.49,6.35 Q5.2
  Bottom 0.203: R18.2 86.36,6.67 90.01,6.67 90.33,6.35 Q5.2 | JP6.3 155.26,6.35 153.99,5.08 147.16,5.08 144.78,2.7 v110.49,2.7
L4
  Bottom 0.203: R20.2 121.92,6.67 125.57,6.67 125.89,6.35 Q7.2 126.68,6.35 127.79,5.24 144.94,5.24 146.05,6.35 JP6.4
L5  (via drill 0.51)
  Top 0.203: JP6.5 156.21,9.84 154.94,11.11 154.94,11.75 153.99,12.7 v64.14,12.7 | v43.5,12.7 37.15,6.35 Q2.2
  Bottom 0.203: R15.2 33.02,6.67 36.67,6.67 36.99,6.35 Q2.2 | v43.5,12.7 v64.14,12.7
L6
  Top 0.203: JP6.6 150.97,8.89 144.94,2.86 113.35,2.86 110.01,6.19 110.01,9.21 109.38,9.84 76.2,9.84 72.71,6.35 Q4.2
  Bottom 0.203: R17.2 68.58,6.67 72.23,6.67 72.55,6.35 Q4.2
L7
  Top 0.203: JP6.7 156.21,10.48 157.48,9.21 157.48,3.49 156.37,2.38 112.24,2.38 108.27,6.35 Q6.2
  Bottom 0.203: R19.2 104.14,6.67 107.79,6.67 108.11,6.35 Q6.2
L8
  Top 0.203: JP6.8 148.91,11.43 143.83,6.35 Q8.2
  Bottom 0.203: R21.2 139.7,6.67 143.35,6.67 143.67,6.35 Q8.2
LAYER1
  Top 0.203: Q1.1 23.81,8.57 23.81,9.21 30.64,16.03 32.07,16.03 33.18,17.14 LPC1.73
LAYER2
  Bottom 0.203: Q3.1 54.77,4.13 48.9,4.13 33.34,19.69 LPC1.72
LAYER3
  Top 0.203: Q5.1 90.33,3.97 84.61,3.97 83.5,2.86 53.82,2.86 48.58,8.1 48.58,9.21 39.21,18.57 36.99,18.57 33.34,22.23 LPC1.71
LAYER4
  Bottom 0.203: LPC1.70 30.16,17.14 29.05,18.26 27.78,18.26 26.99,17.46 26.99,16.35 35.88,7.46 38.26,7.46 43.81,1.91 108.43,1.91 110.49,3.97 125.89,3.97 Q7.1
LAYER5
  Top 0.203: Q2.1 36.99,4.13 34.45,6.67 34.45,17.62 33.5,18.57 31.91,18.57 30.8,19.69 LPC1.69
LAYER6
  Top 0.203: Q4.1 72.55,4.13 71.44,4.13 60.01,15.56 44.45,15.56 38.89,21.11 36.04,21.11 33.81,23.34 31.91,23.34 30.8,22.23 LPC1.68
LAYER7
  Bottom 0.203: Q6.1 108.11,3.97 92.71,3.97 91.12,2.38 45.72,2.38 32.07,16.03 29.37,16.03 28.26,17.14 LPC1.67
LAYER8
  Bottom 0.203: Q8.1 143.67,4.13 128.27,4.13 127.16,5.24 58.42,5.24 56.04,2.86 49.21,2.86 33.5,18.57 29.37,18.57 28.26,19.69 LPC1.66
N$1
  Top 0.203: R5.1 106.68,83.03 104.78,81.12 103.98,81.12 IC5.27
N$2
  Top 0.203: IC6.27 103.98,62.07 104.78,62.07 105.89,63.18 105.89,64.29 106.68,65.09 R6.1
N$3
  Top 0.203: R7.1 106.68,44.93 104.78,43.02 103.98,43.02 IC7.27
N$4
  Top 0.203: R8.1 106.68,27.15 104.78,25.24 103.98,25.24 IC8.27
N$5
  Top 0.203: R1.1 69.85,83.03 67.94,81.12 67.15,81.12 IC1.27
N$6
  Top 0.203: R9.1 144.78,83.03 142.88,81.12 142.08,81.12 IC9.27
N$7
  Top 0.203: R10.1 144.78,63.98 142.88,62.07 142.08,62.07 IC10.27
N$8
  Top 0.203: R11.1 144.78,44.93 142.88,43.02 142.08,43.02 IC11.27
N$9
  Top 0.203: R12.1 144.78,27.15 142.88,25.24 142.08,25.24 IC12.27
N$16
  Top 0.203: R2.1 69.85,63.98 67.94,62.07 67.15,62.07 IC2.27
N$26
  Top 0.203: R3.1 69.85,44.93 67.94,43.02 67.15,43.02 IC3.27
N$35
  Top 0.203: R4.1 69.85,27.15 67.94,25.24 67.15,25.24 IC4.27
RESET_N
  Top 0.203: 2.7,79.22 1.59,78.11 S1.4 | 2.7,79.22 2.86,79.38 R13.2 | 2.7,79.22 2.7,74.93 C13.2
  Bottom 0.203: LPC1.4 3.97,75.56 1.59,77.95 S1.4
SCLK  (via drill 0.51)
  Top 0.203: v136.37,23.81 134.94,23.81 IC12.4 | v133.19,41.59 134.78,41.59 IC11.4 | v133.19,60.64 134.78,60.64 IC10.4 | IC9.4 134.78,79.69 v133.19,79.69 124.46,79.69 112.87,68.1 108.11,68.1 103.5,72.71 100.33,72.71 99.06,73.98 | IC8.4 96.68,23.97 95.73,23.97 94.61,25.08 94.61,31.59 97.79,34.77 97.79,41.43 97.63,41.59 96.84,41.59 IC7.4 96.68,41.75 95.73,41.75 95.09,42.39 95.09,44.13 98.74,47.78 v98.74,56.52 | v98.27,60.64 96.84,60.64 IC6.4 | IC5.4 96.84,79.69 98.42,79.69 99.38,78.74 v99.38,76.2 98.42,75.25 98.42,74.61 99.06,73.98 | v58.26,79.85 59.85,79.85 IC1.4 | IC4.4 59.85,23.97 58.9,23.97 58.26,24.61 58.26,32.07 60.96,34.77 60.96,41.43 60.8,41.59 60.01,41.59 IC3.4 59.85,41.75 58.9,41.75 58.74,41.91 58.74,43.97 61.28,46.51 | 61.28,46.51 61.44,46.67 61.44,60.01 60.8,60.64 60.01,60.64 IC2.4 59.85,60.8 58.9,60.8 58.74,60.96 58.74,63.02 61.91,66.2 61.91,71.91 | LPC1.11 26.99,57.78 38.26,46.51 61.28,46.51 | 61.91,71.91 v61.91,76.2 | 99.06,73.98 95.25,70.17 92.71,70.17 90.65,68.1 65.72,68.1 61.91,71.91
  Bottom 0.203: v136.37,23.81 135.41,24.77 135.41,39.37 v133.19,41.59 v133.19,60.64 v133.19,79.69 | v98.74,56.52 98.27,56.99 v98.27,60.64 99.85,62.23 99.85,68.1 100.33,68.58 100.33,75.25 v99.38,76.2 | JP1.3 58.26,90.01 v58.26,79.85 v61.91,76.2
SIN  (via drill 0.51)
  Top 0.203: v63.34,82.55 63.34,81.12 61.44,79.22 60.01,79.22 IC1.5 | JP1.5 v57.31,86.52
  Bottom 0.203: v63.34,82.55 63.34,87.79 JP1.5 | LPC1.13 16.83,52.7 38.58,74.45 45.24,74.45 v57.31,86.52
SIN_B  (via drill 0.51)
  Top 0.203: v60.48,53.18 60.96,53.66 60.96,59.85 60.8,60.01 60.01,60.01 IC2.5 | v57.31,69.69 v57.31,64.14 | v64.14,76.52 64.14,76.99 66.2,79.06 66.99,79.06 IC1.24
  Bottom 0.203: v60.48,53.18 60.48,60.96 v57.31,64.14 | v64.14,76.52 v57.31,69.69
SIN_C  (via drill 0.51)
  Top 0.203: v58.26,45.56 58.26,41.75 58.9,41.12 59.85,41.12 IC3.5 | v62.87,50.16 62.87,56.67 66.2,60.01 66.99,60.01 IC2.24
  Bottom 0.203: v62.87,50.16 v58.26,45.56
SIN_D  (via drill 0.51)
  Top 0.203: v61.59,23.34 60.01,23.34 IC4.5 | v70.48,25.72 70.48,26.35 77.47,33.34 77.47,43.5 76.52,44.45 72.87,44.45 69.06,40.64 68.26,40.64 67.94,40.96 67.15,40.96 IC3.24
  Bottom 0.203: v61.59,23.34 63.82,23.34 64.14,23.65 67.79,23.65 68.42,23.02 69.06,23.02 70.48,24.45 v70.48,25.72
VCC  (via drill 0.51)
  Top 0.203: 67.15,83.82 67.15,81.76 IC1.28 | 67.15,83.82 67.31,83.98 C1.2 67.15,83.82 | v64.61,83.82 67.15,83.82 | IC2.28 67.15,62.71 v67.15,63.66 67.15,64.77 67.31,64.93 C2.2 | IC4.28 67.15,25.88 v67.15,26.83 67.15,27.94 67.31,28.1 C4.2 | IC3.28 67.15,43.66 v67.15,44.61 67.15,45.72 67.31,45.88 C3.2 | IC9.28 142.08,81.76 v142.08,82.71 142.08,83.82 142.24,83.98 C9.2 | IC10.28 142.08,62.71 v142.08,63.66 142.08,64.77 142.24,64.93 C10.2 | IC12.28 142.08,25.88 v142.08,26.83 142.08,27.94 142.24,28.1 C12.2 | IC11.28 142.08,43.66 v142.08,44.61 142.08,45.72 142.24,45.88 C11.2 | C5.2 104.14,83.98 103.98,83.82 103.98,81.76 IC5.28 103.82,81.6 v102.39,81.6 | C6.2 104.14,64.93 103.98,64.77 103.98,62.71 IC6.28 103.82,62.55 103.03,62.55 v101.44,60.96 | 103.98,27.94 103.98,25.88 IC8.28 | 103.98,27.94 104.14,28.1 C8.2 103.98,27.94 | 103.98,45.09 103.98,45.72 104.14,45.88 C7.2 | 103.98,45.09 103.98,43.66 IC7.28 | v101.44,27.94 103.98,27.94 | 103.98,45.09 v101.44,42.55
  Bottom 0.203: 61.12,92.55 62.23,91.44 62.23,89.85 64.61,87.47 v64.61,83.82 64.61,79.38 67.15,76.83 v67.15,63.66 v67.15,44.61 v67.15,26.83 | v142.08,26.83 v142.08,44.61 v142.08,63.66 142.08,81.12 | 142.08,81.12 v142.08,82.71 | v101.44,27.94 v101.44,42.55 v101.44,60.96 102.39,61.91 102.39,81.12 | 102.39,81.12 142.08,81.12 | 102.39,81.12 v102.39,81.6 89.06,94.93 63.5,94.93 61.12,92.55 | 61.12,92.55 JP1.6
VPRG  (via drill 0.51)
  Top 0.203: 50.32,31.27 49.53,32.07 49.53,43.5 50.48,44.45 54.93,44.45 58.9,40.48 59.85,40.48 IC3.6 | 50.32,31.27 58.9,22.7 59.85,22.7 IC4.6 60.01,22.54 60.64,22.54 66.04,17.14 66.04,16.99 66.99,16.03 76.04,16.03 89.22,29.21 | LPC1.25 16.51,22.23 25.56,31.27 50.32,31.27 | IC2.6 59.85,59.53 58.9,59.53 58.26,60.17 58.26,70.17 60.96,72.87 60.96,78.11 60.64,78.42 60.01,78.42 IC1.6 59.85,78.58 56.2,78.58 54.61,80.17 54.61,93.03 56.04,94.46 63.34,94.46 65.09,92.71 JP1.10 | 132.56,60.01 132.24,60.32 132.24,69.22 135.89,72.87 135.89,78.11 135.57,78.42 134.94,78.42 IC9.6 | 132.56,60.01 133.03,59.53 134.78,59.53 IC10.6 | 133.03,26.67 133.03,31.91 133.67,32.54 | 133.03,26.67 133.03,23.49 133.83,22.7 134.78,22.7 IC12.6 | 133.67,32.54 135.89,34.77 135.89,40 135.57,40.32 134.94,40.32 IC11.6 | 89.22,29.21 86.36,32.07 86.36,43.5 87.31,44.45 91.12,44.45 | 89.22,29.21 95.73,22.7 96.68,22.7 IC8.6 96.84,22.54 97.47,22.54 97.79,22.23 97.79,22.07 103.82,16.03 112.87,16.03 123.51,26.67 133.03,26.67 | 91.12,44.45 95.09,40.48 96.68,40.48 IC7.6 | 97.79,58.26 97.79,51.12 91.12,44.45 | 97.79,58.26 97.79,59.05 97.47,59.37 96.84,59.37 IC6.6 | v98.42,78.42 96.84,78.42 IC5.6 | 97.79,58.26 v99.38,59.85 | v132.24,59.69 132.56,60.01 | 133.67,32.54 v132.24,33.97
  Bottom 0.203: v99.38,59.85 100.49,60.96 100.49,68.1 100.81,68.42 100.81,76.04 v98.42,78.42 98.42,79.06 83.03,94.46 63.66,94.46 62.23,93.03 62.23,92.39 63.18,91.44 63.82,91.44 65.09,92.71 JP1.10 | v132.24,33.97 v132.24,59.69
XLAT  (via drill 0.51)
  Top 0.203: 61.44,41.27 61.44,41.59 60.8,42.23 60.01,42.23 IC3.3 | 61.44,41.27 61.44,34.61 58.74,31.91 58.74,24.77 58.9,24.61 59.85,24.61 IC4.3 | v61.91,60.8 61.44,61.28 60.01,61.28 IC2.3 | 61.44,41.27 v63.02,42.86 | 133.67,63.66 133.67,70.01 136.37,72.71 136.37,79.69 135.73,80.33 134.94,80.33 IC9.3 134.78,80.49 133.67,80.49 132.08,82.07 v107,82.07 | 133.67,63.66 133.67,61.59 133.83,61.44 134.78,61.44 IC10.3 | v136.37,25.08 135.89,24.61 134.94,24.61 IC12.3 | v134.3,44.61 133.67,43.97 133.67,42.55 133.83,42.39 134.78,42.39 IC11.3 | v134.14,63.66 133.67,63.66 | IC8.3 96.68,24.61 95.73,24.61 95.09,25.24 95.09,31.43 98.27,34.61 98.27,41.59 97.63,42.23 96.84,42.23 IC7.3 96.68,42.39 95.73,42.39 95.57,42.55 95.57,43.97 100.33,48.74 100.33,60.17 98.9,61.59 97.95,61.59 97.79,61.44 96.84,61.44 IC6.3 96.68,61.44 v92.71,61.44 | v61.44,80.49 60.01,80.49 IC1.3 | v61.44,86.84 61.44,88.11 JP1.7 | v72.07,85.09 76.99,80.17 v92.71,80.17 95.41,80.17 95.57,80.33 96.68,80.33 IC5.3 96.84,80.49 99.22,80.49 101.44,82.71 v103.03,82.71
  Bottom 0.203: 61.91,52.39 v61.91,60.8 55.4,67.31 55.4,80.01 56.04,80.64 56.67,80.64 57.31,80.01 57.31,79.53 61.59,75.25 62.23,75.25 62.87,75.88 62.87,79.06 v61.44,80.49 v61.44,86.84 | 61.91,52.39 63.82,50.48 63.82,43.66 v63.02,42.86 | LPC1.23 16.83,27.3 38.58,49.05 58.58,49.05 61.91,52.39 | v136.37,25.08 136.37,42.55 v134.3,44.61 134.14,44.77 v134.14,63.66 | v72.07,85.09 67.31,89.85 67.31,90.49 66.36,91.44 64.77,91.44 JP1.7 | v92.71,80.17 v92.71,61.44 | v107,82.07 103.66,82.07 v103.03,82.71
(copper drawn outside any net)
  shapes: Top area x2